# EAGLE design lat_stm_zybo (EAGLE 9.6.2)
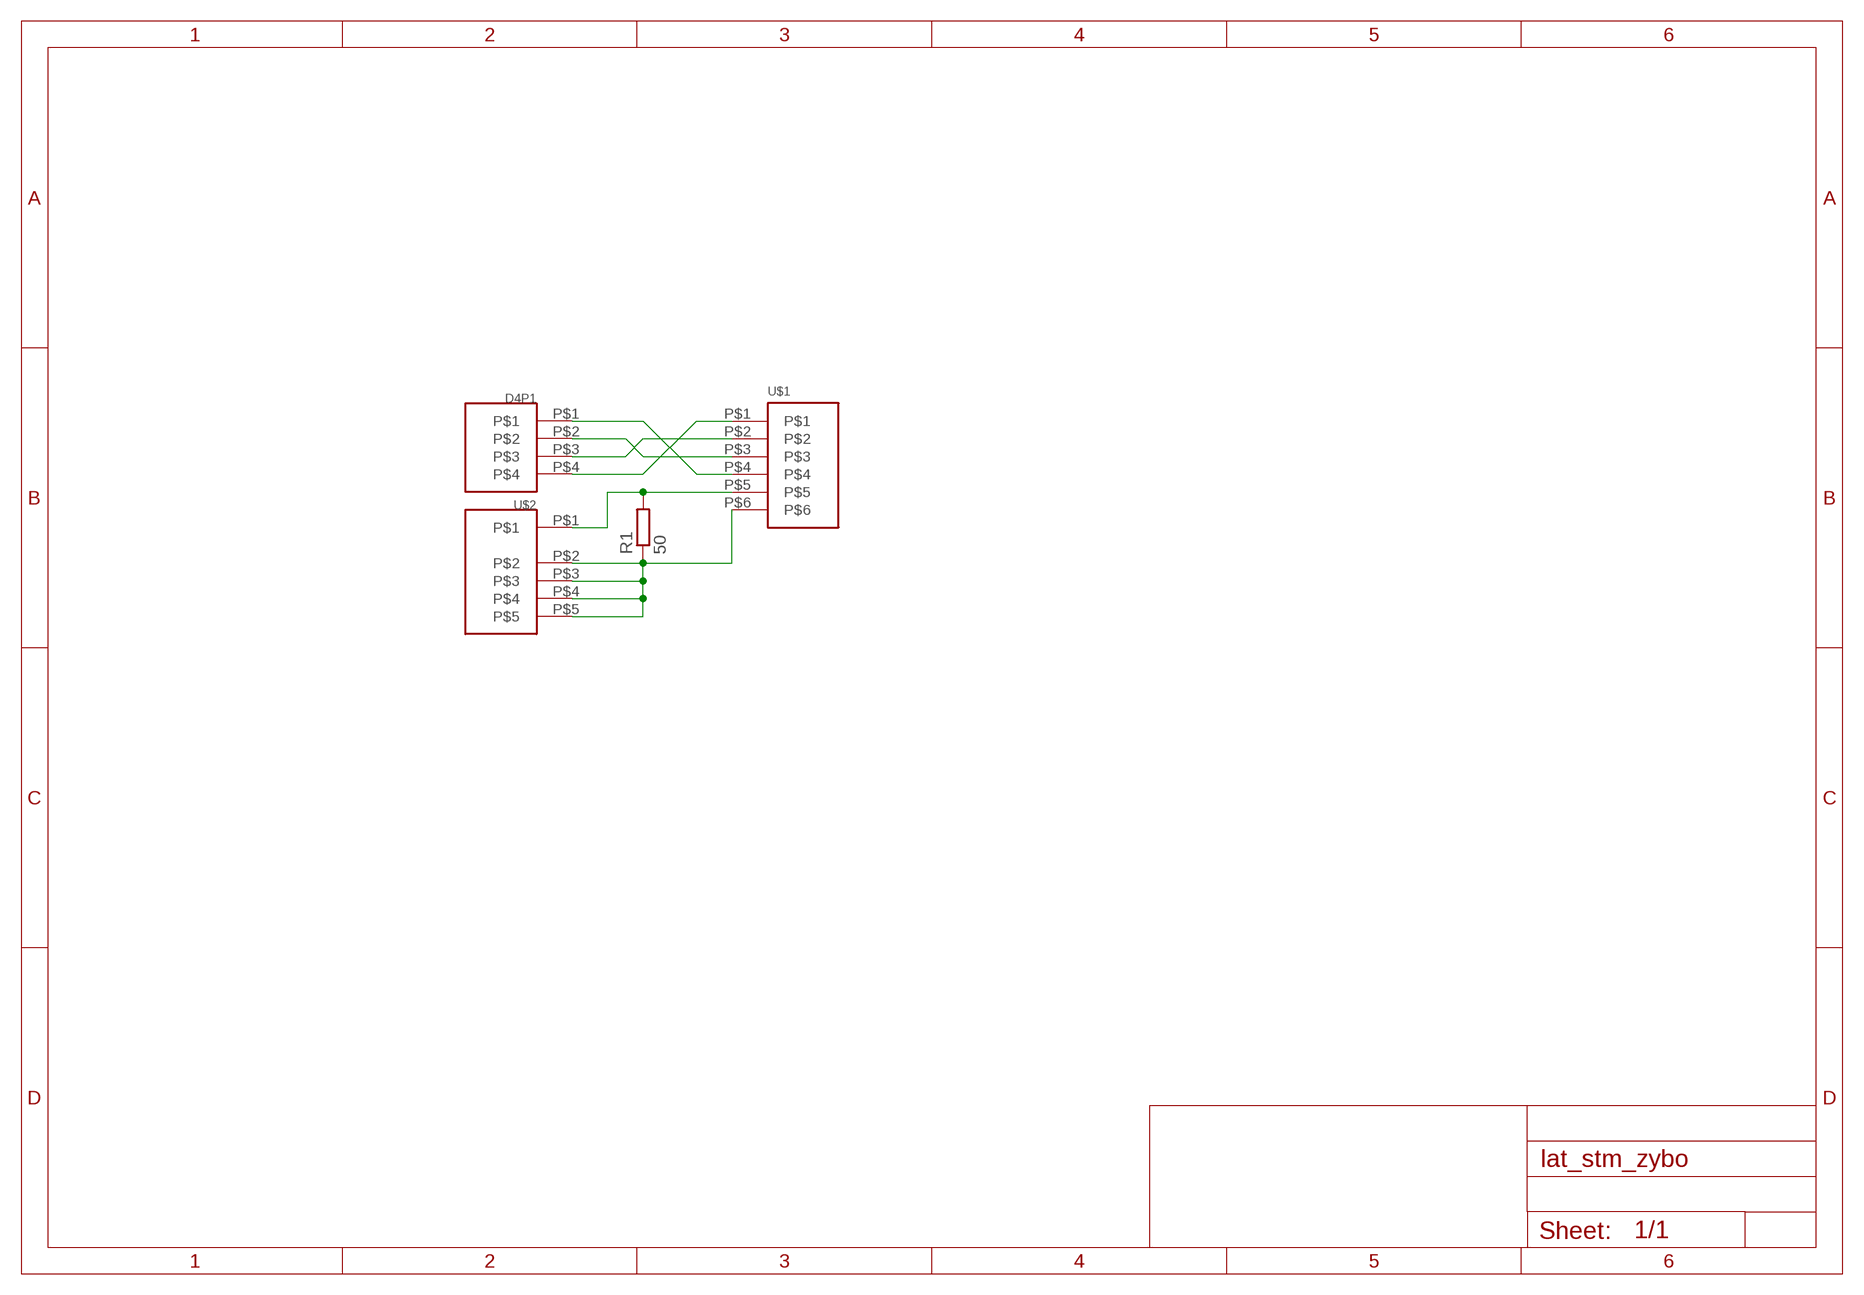
[diagram p0: schematic, sheet 1]

## Parts
D4P1  DF1E-4P  [DF1E-4P]
R1  50  R-EU_0204/7  [0204/7]
U$1  DF1E-6P  [DF1E-6P]
U$2  546-4049  [546-4049]

## Nets
N$1: D4P1.P$1 U$1.P$4
N$2: D4P1.P$2 U$1.P$3
N$3: D4P1.P$3 U$1.P$2
N$4: D4P1.P$4 U$1.P$1
N$5: R1.2 U$1.P$5 U$2.P$1
N$6: R1.1 U$1.P$6 U$2.P$2 U$2.P$3 U$2.P$4 U$2.P$5

## Library data of the parts
D4P1 = lib_test:DF1E-4P
R1 = rcl:R-EU_: RESISTOR, European symbol; SPICEPREFIX: R
U$1 = lib_test:DF1E-6P
U$2 = lib_test:546-4049

## Board
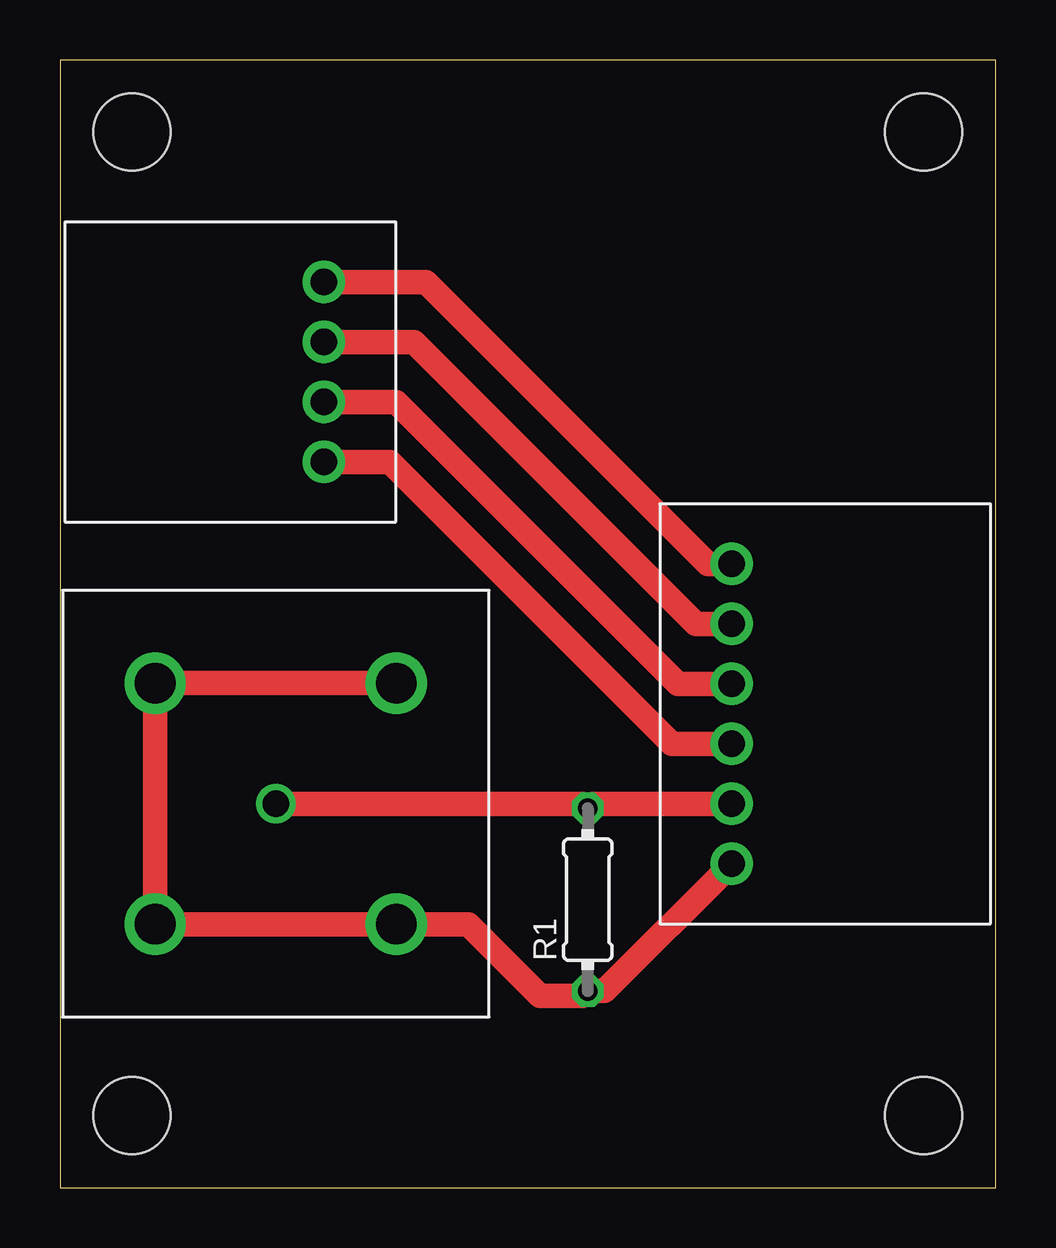
[diagram p1: board, top side]

Size 39 x 47 mm. Coordinates in mm from the lower left corner, seen from the top.
Outline: 0,0 39,0 39,47 0,47 0,0
Copper layers (1*16): Top 0.035mm / dielectric 1.5mm / Bottom 0.035mm
Design rules "default": minimum track width 6mil, minimum drill 0.35mm, track to track 6mil, track to pad 6mil, pad to pad 6mil, via to via 6mil, smd to smd 6mil, copper to edge 40mil, drill to drill 6mil, minimum pad ring 10mil, minimum via ring 8mil, stop-mask expansion 4mil, vias tented up to drill 0mil, thermal gap 10mil
Holes 3.2 mm at 3,3 3,44 36,44 36,3

### Footprints (pad centres in the part's own frame; a part is rotated, then mirrored left to right if it is on the bottom)
DF1E-4P = drill 1.1 pad 1.778: P$1 0,3.75; P$2 0,1.25; P$3 0,-1.25; P$4 0,-3.75
0204/7 = drill 0.813 octagon: 1 -3.81,0; 2 3.81,0
DF1E-6P = drill 1.1 pad 1.778: P$1 0,6.25; P$2 0,3.75; P$3 0,1.25; P$4 0,-1.25; P$5 0,-3.75; P$6 0,-6.25
546-4049 = drill 1.1: P$1 0,0 | drill 1.7: P$2 -5.025,5.025; P$3 5.025,5.025; P$4 5.025,-5.025; P$5 -5.025,-5.025

### Placement (x,y rotation side)
D4P1  11,34 180 top
R1  22,12 90 top
U$1  28,19.75 0 top
U$2  9,16 0 top

### Tracks (layer width: path | path; a pad name or v marks a point on that pad's centre or on a via)
N$1
  Top 1.016: D4P1.P$1 13.75,30.25 25.5,18.5 U$1.P$4
N$2
  Top 1.016: D4P1.P$2 14,32.75 25.75,21 U$1.P$3
N$3
  Top 1.016: D4P1.P$3 14.75,35.25 26.5,23.5 U$1.P$2
N$4
  Top 1.016: D4P1.P$4 15.25,37.75 27,26 U$1.P$1
N$5
  Top 1.016: U$2.P$1 21.81,16 R1.2 22.19,16 U$1.P$5
N$6
  Top 1.016: U$2.P$3 U$2.P$2 U$2.P$5 U$2.P$4 17.02,10.97 20,8 21.81,8 R1.1 22.69,8.19 U$1.P$6